# Altium schematic sheet ClientMainBoard.SchDoc
size A
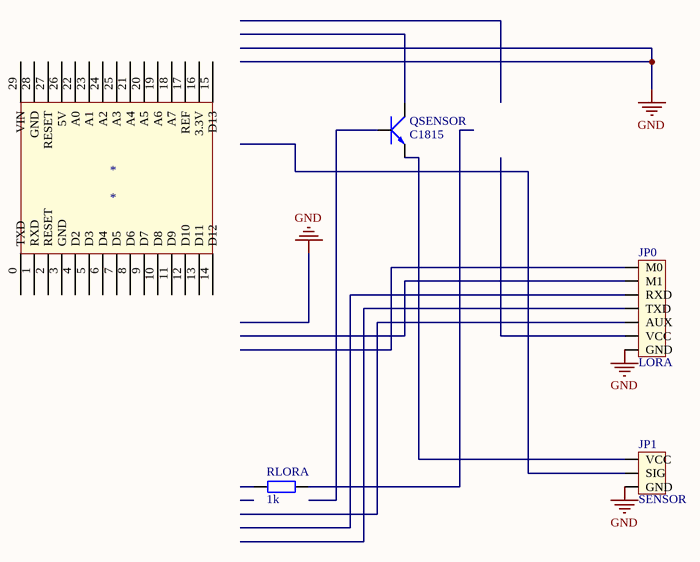
[diagram p0: ClientMainBoard.SchDoc]

## Parts
*  *  [Arduino nano]
JP0  LORA  [CON7]
JP1  SENSOR  [CON3]
QSENSOR  C1815  [QTO-92]
RLORA  1k  [R1/4W]

## Nets
GND: JP0.7(GND) JP1.3(GND)
NetJP1_1: JP1.1(VCC) QSENSOR.1(E)

Not connected (* = marked no-connect by the designer): * 0(TXD) 1(RXD) 2(RESET) 3(GND) 4(D2) 5(D3) 6(D4) 7(D5) 8(D6) 9(D7) 10(D8) 11(D9) 12(D10) 13(D11) 14(D12) 15(D13) 16(3.3V) 17(REF) 18(A7) 19(A6) 20(A5) 21(A4) 22(A0) 23(A1) 24(A2) 25(A3) 26(5V) 27(RESET) 28(GND) 29(VIN); JP0 1(M0) 2(M1) 3(RXD) 4(TXD) 5(AUX) 6(VCC); JP1 2(SIG); QSENSOR 2(C) 3(B); RLORA 1 2

## Library data of the parts
* = arduinoNano
JP0 = Con7: Connector 7; Value: Connector 7
JP1 = Con3: Connector 3; Value: Connector 3
QSENSOR = C1815: NPN 600mW, ECB; Value: C1815
RLORA = R1/4W: Resistor 1/4W; Value: R1/4W - 1K